# EAGLE design konashi-mini (EAGLE 6.5.0)
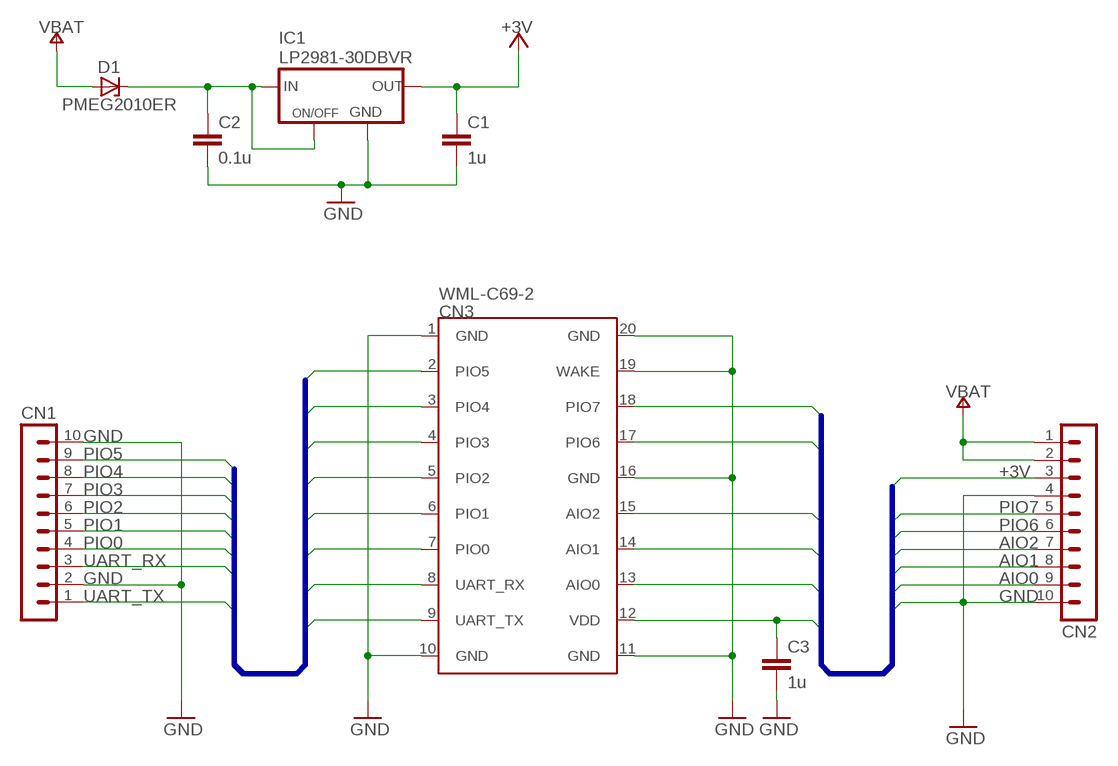
[diagram p0: schematic, sheet 1]

## Parts
C1  1u  C-EUC0603  [C0603]
C2  0.1u  C-EUC0603  [C0603]
C3  1u  C-EUC0603  [C0603]
CN1  MA10-1_LARGE  [MA10-1_LARGE]
CN2  MA10-1_LARGE  [MA10-1_LARGE]
CN3  WML-C69-2  [WML-C69]
D1  PMEG2010ER  [SOD123-W]
IC1  LP2981-30DBVR  [SOT-23]

## Nets
+3V: C1.1 C3.1 CN2.3 CN3.12(VDD) IC1.5(OUT)
AIO0: CN2.9 CN3.13(AIO0)
AIO1: CN2.8 CN3.14(AIO1)
AIO2: CN2.7 CN3.15(AIO2)
GND: C1.2 C2.2 C3.2 CN1.2 CN1.10 CN2.4 CN2.10 CN3.1(GND) CN3.10(GND) CN3.11(GND) CN3.16(GND) CN3.19(WAKE) CN3.20(GND) IC1.2(GND)
N$10: C2.1 D1.K(C) IC1.1(IN) IC1.3(ON/OFF)
PIO0: CN1.4 CN3.7(PIO0)
PIO1: CN1.5 CN3.6(PIO1)
PIO2: CN1.6 CN3.5(PIO2)
PIO3: CN1.7 CN3.4(PIO3)
PIO4: CN1.8 CN3.3(PIO4)
PIO5: CN1.9 CN3.2(PIO5)
PIO6: CN2.6 CN3.17(PIO6)
PIO7: CN2.5 CN3.18(PIO7)
UART_RX: CN1.3 CN3.8(UART_RX)
UART_TX: CN1.1 CN3.9(UART_TX)
VBATT: CN2.1 CN2.2 D1.A ; supply symbol labelled VBAT

## Buses
AIO0,AIO1,AIO2,PIO6,PIO7,+3V,VBAT,GND
PIO5,PIO4,PIO3,PIO2,PIO1,PIO0,UART_RX,UART_TX,GND

## Library data of the parts
C1-C3 = rcl:C-EU: CAPACITOR, European symbol
CN1 CN2 = con-std:MA10-1_LARGE
CN3 = ble_CSR:WML-C69-2
D1 = diode:PMEG2010ER
IC1 = LDO:LP2981-30DBVR

## Board
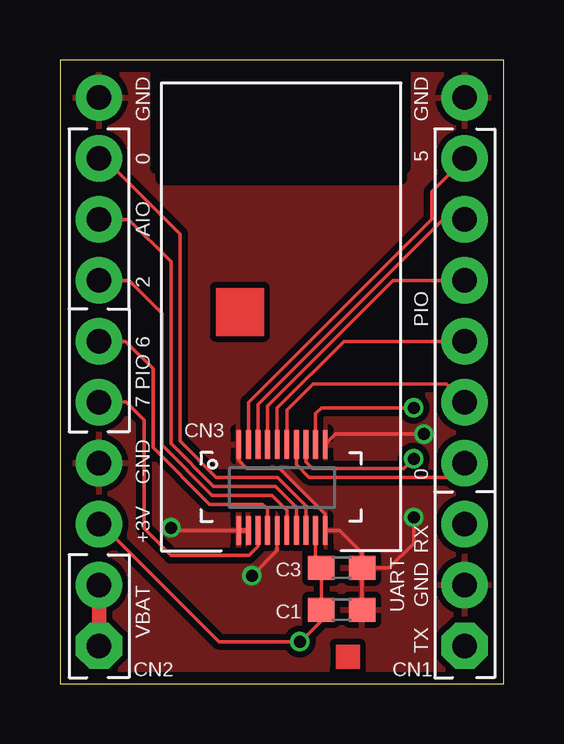
[diagram p1: board, top side]
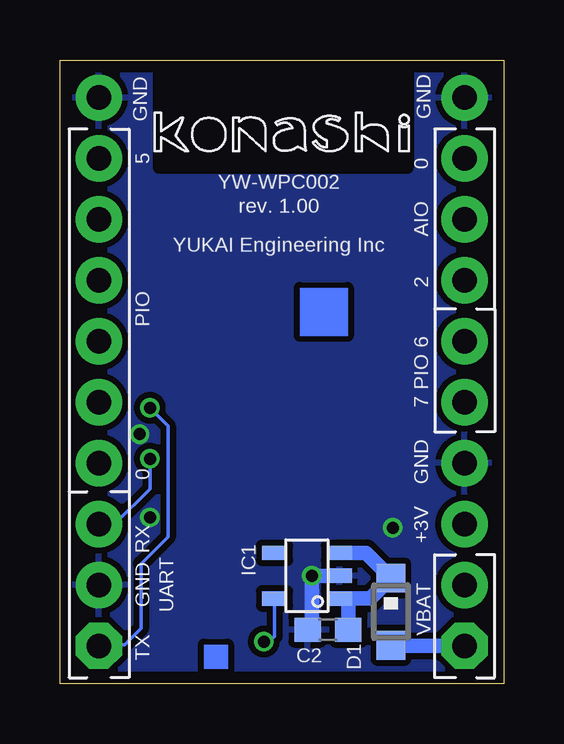
[diagram p2: board, bottom side, seen from below]

Size 18.5 x 26 mm. Coordinates in mm from the lower left corner, seen from the top.
Outline: 0,0 18.5,0 18.5,26 0,26 0,0
Copper layers (1*16): Top 0.035mm / dielectric 1.53mm / Bottom 0.035mm
Design rules "pban_5mil-l2": minimum track width 5mil, minimum drill 0.3mm, track to track 5mil, track to pad 0.229mm, pad to pad 5mil, via to via 5mil, smd to smd 5mil, copper to edge 0.5mm, drill to drill 0.5mm, minimum pad ring 0.15mm, minimum via ring 0.15mm, stop-mask expansion 4mil, vias tented up to drill 0.35mm, thermal gap 10mil
tRestrict: area 4,21.5 to 14.4,26
bRestrict: area 4,21.5 to 14.4,26

### Footprints (pad centres in the part's own frame; a part is rotated, then mirrored left to right if it is on the bottom)
C0603 = smd 1.1 x 1: 1 -0.85,0; 2 0.85,0
MA10-1_LARGE = drill 1.016 pad 1.93 octagon: 1 -11.43,0 | drill 1.016 pad 1.93: 2 -8.89,0; 3 -6.35,0; 4 -3.81,0; 5 -1.27,0; 6 1.27,0; 7 3.81,0; 8 6.35,0; 9 8.89,0; 10 11.43,0
WML-C69 = smd 0.2 x 1.2: 1 4.209,4.469; 2 4.609,4.469; 3 5.009,4.469; 4 5.409,4.469; 5 5.809,4.469; 6 6.209,4.469; 7 6.609,4.469; 8 7.009,4.469; 9 7.409,4.469; 10 7.809,4.469; 11 7.809,0.889; 12 7.409,0.889; 13 7.009,0.889; 14 6.609,0.889; 15 6.209,0.889; 16 5.809,0.889; 17 5.409,0.889; 18 5.009,0.889; 19 4.609,0.889; 20 4.209,0.889
SOD123-W = smd 1.2 x 1.2: A 1.4,0; K -1.4,0
SOT-23 = smd 0.6 x 1.05: 1 -0.95,-1.35; 2 0,-1.35; 3 0.95,-1.35; 4 0.95,1.35; 5 -0.95,1.35

### Placement (x,y rotation side)
C1  11.75,3.08 0 top
C2  7.33,2.25 180 bottom
C3  11.75,4.83 0 top
CN1  16.88,13 90 top
CN2  1.63,13 90 top
CN3  3.25,5.5 0 top
D1  4.7,3 270 bottom
IC1  8.2,4.5 90 bottom
U$4  [KONASHI_LOGO_WIRE_MINI]  9.25,23 0 bottom

### Tracks (layer width: path | path; a pad name or v marks a point on that pad's centre or on a via)
+3V  (via drill 0.5)
  Top 0.152: CN3.12 10.66,4.83 C3.1 C1.1 10.9,2.62 10.03,1.75 v10,1.75 6.62,1.75 1.73,6.65 CN2.3
  Bottom 0.152: IC1.5 9.55,1.97 9.77,1.75 v10,1.75
AIO0
  Top 0.152: CN3.13 10.26,7.41 9.06,8.6 6.51,8.6 5,10.11 5,18.75 1.86,21.89 CN2.9
AIO1
  Top 0.152: CN3.14 9.86,7.35 8.99,8.22 6.42,8.22 4.62,10.02 4.62,17.6 2.88,19.35 CN2.8
AIO2
  Top 0.152: CN3.15 9.46,7.23 8.84,7.85 6.34,7.85 4.25,9.95 4.25,15.44 2.88,16.81 CN2.7
GND  (via drill 0.5)
  Top 0.152: C3.2 C1.2 | C3.2 12.6,5.44 11.65,6.39 CN3.11 11.06,7.07 9.15,8.97 7.78,8.97 7.46,9.29 CN3.1 | CN3.16 9.06,5.56 v8,4.5 | C3.2 13.72,4.83 14.75,5.85 v14.75,6.92 | 15.14,10.37 v15.18,10.4 11.49,10.4 CN3.10 | CN3.20 4.74,6.39 v4.62,6.5
  Top 0.203: CN3.20 CN3.19
  Bottom 0.152: 8,2.23 8.15,2.23 C2.2
  Bottom 0.61: IC1.2 v8,4.5 8,2.23
  pour Bottom (isolate 0.254): 0,26 18.5,26 18.5,0 0,0
  pour Top (isolate 0.254): 0,26 18.5,26 18.5,0 0,0
N$10
  Bottom 0.61: 6.47,3.55 C2.1 | IC1.3 5.75,5.45 D1.K 5.55,3.55 6.47,3.55 | IC1.1 6.47,3.55
PIO0
  Top 0.152: CN3.7 9.86,9.13 10.39,8.6 16.29,8.6 16.54,8.86 | CN1.4 16.54,8.86 | 16.54,8.86 16.51,8.89 CN1.4
PIO1
  Top 0.152: CN3.6 9.46,11.41 10.55,12.5 16.11,12.5 CN1.5
PIO2
  Top 0.152: CN3.5 9.06,11.48 11.85,14.27 CN1.6
PIO3
  Top 0.152: CN3.4 8.66,11.58 13.89,16.81 CN1.7
PIO4
  Top 0.152: CN3.3 8.26,11.64 15.96,19.35 CN1.8
PIO5
  Top 0.152: CN3.2 7.86,11.72 15.5,19.37 15.5,20.51 CN1.9
PIO6
  Top 0.152: CN3.17 8.66,7.27 8.46,7.47 6.25,7.47 3.88,9.85 3.88,13.13 2.74,14.27 CN2.6
PIO7
  Top 0.152: 8.26,6.03 CN3.18 8.26,5.72 7.88,5.34 4.63,5.34 3.5,6.48 3.5,10.99 2.76,11.73 CN2.5
UART_RX  (via drill 0.5)
  Top 0.152: CN3.8 10.26,9.25 10.53,8.97 14.35,8.97 v14.75,9.38
  Bottom 0.152: v14.75,9.38 14.75,8.11 16.21,6.65 CN1.3
UART_TX  (via drill 0.5)
  Top 0.152: CN3.9 10.66,11.25 10.91,11.5 v14.75,11.5
  Bottom 0.152: v14.75,11.5 14,10.75 14,6.12 15.12,5 15.12,2.3 15.8,1.62 16.88,1.62 CN1.1
VBATT
  Top 0.61: CN2.1 CN2.2
  Bottom 0.152: 4.47,1.57 4.67,1.57 D1.A
  Bottom 0.61: 4.47,1.57 CN2.1
(copper drawn outside any net)
  shapes: Bottom area x2, Top area x2

### Text on the board
tPlace: GND | GND | 0 | 5 | AIO | 2 | PIO | 6 | PIO | 7 | GND | 0 | +3V | RX | UART | GND | VBAT | TX
bPlace: GND | GND | 0 | 5 | YW-WPC002 | rev. 1.00 | AIO | YUKAI Engineering Inc | 2 | PIO | 6 | PIO | 7 | GND | 0 | +3V | RX | UART | GND | VBAT | TX